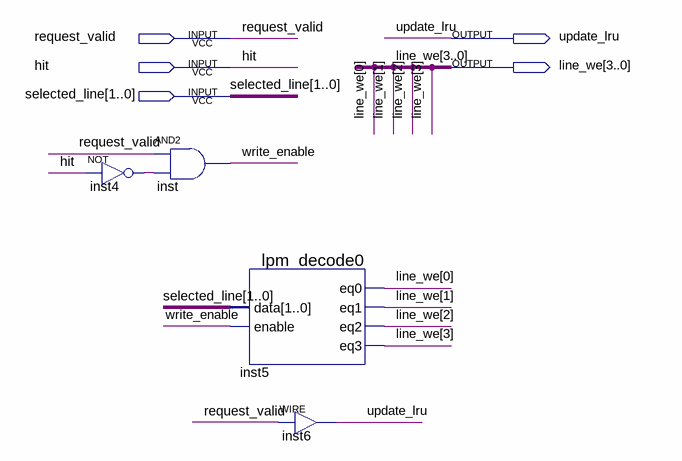
[diagram p0: schematic sheet]
// Quartus schematic write_control.bdf as structural Verilog: 4 symbols, 5 pins
module write_control (
  input  request_valid,
  input  hit,
  input  [1:0] selected_line,
  output update_lru,
  output [3:0] line_we
);

  wire inst4_out, write_enable;

  not inst4 (inst4_out, hit);
  and inst (write_enable, request_valid, inst4_out);
  lpm_decode0 inst5 (
    .data(selected_line), .enable(write_enable), .eq0(line_we[0]), .eq1(line_we[1]), .eq2(line_we[2]),
    .eq3(line_we[3]));
  assign update_lru = request_valid;  // WIRE inst6
endmodule
